# Altium schematic sheet Overview.SchDoc
size A4; SheetNumber: 1; SheetTotal: 6
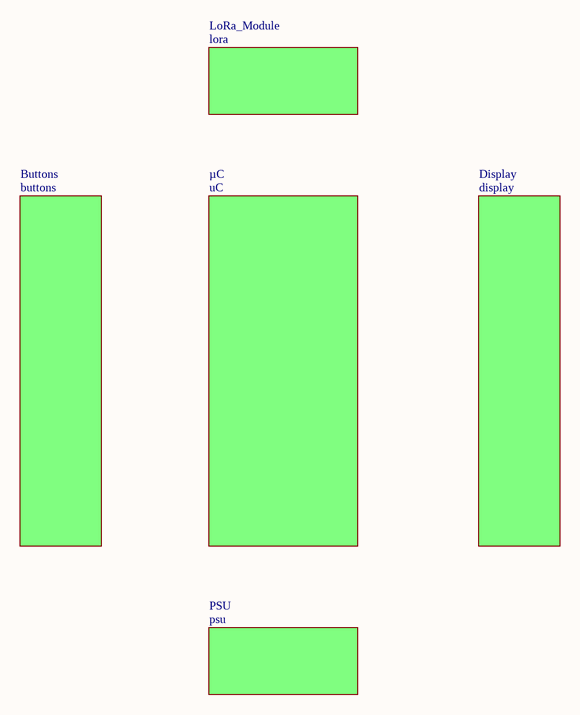
[diagram p0: Overview.SchDoc]

## Sub-sheets
Buttons = buttons: no entries
Display = display: no entries
LoRa_Module = lora: no entries
PSU = psu: no entries
µC = uC: no entries